# Altium schematic sheet Bulkhead_Connector.SchDoc
size A
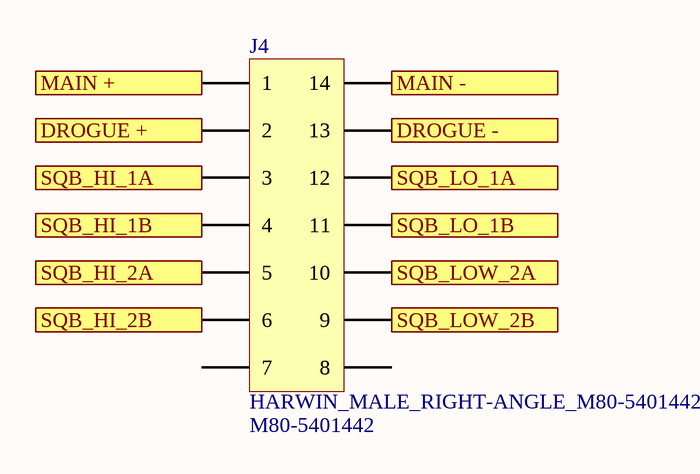
[diagram p0: Bulkhead_Connector.SchDoc]

## Parts
J4  HARWIN_MALE_RIGHT-ANGLE_M80-5401442  Manufacturer Part Number: M80-5401442  [HARWIN_M80-5401442]

## Ports
DROGUE + (in), DROGUE - (in), MAIN + (in), MAIN - (in), SQB_HI_1A (in), SQB_HI_1B (in), SQB_HI_2A (in), SQB_HI_2B (in), SQB_LO_1A (in), SQB_LO_1B (in), SQB_LOW_2A (in), SQB_LOW_2B (in)

## Nets
DROGUE +: J4.2 ; port DROGUE +
DROGUE -: J4.13 ; port DROGUE -
MAIN +: J4.1 ; port MAIN +
MAIN -: J4.14 ; port MAIN -
SQB_HI_1A: J4.3 ; port SQB_HI_1A
SQB_HI_1B: J4.4 ; port SQB_HI_1B
SQB_HI_2A: J4.5 ; port SQB_HI_2A
SQB_HI_2B: J4.6 ; port SQB_HI_2B
SQB_LO_1A: J4.12 ; port SQB_LO_1A
SQB_LO_1B: J4.11 ; port SQB_LO_1B
SQB_LOW_2A: J4.10 ; port SQB_LOW_2A
SQB_LOW_2B: J4.9 ; port SQB_LOW_2B

Not connected (* = marked no-connect by the designer): J4 7 8

## Library data of the parts
J4 = CMP-030-0115-1: 7+7 POS R/A MALE 3mm TAIL W/JS TIN; Manufacturer: Harwin; Pitch: 2mm; Number of poles: 14; Wire connection method: Solder; Number of arrays: 2; Source: connector.SchLib; ComponentLink1URL: https://datasheet.ciiva.com/11751/0900766b80d93463-11751065.pdf; ComponentLink2Description: https://datasheet.ciiva.com/733/m80-540-733786.pdf; Height: 6.05mm; Stock 1: 61; ComponentLink1Description: https://datasheet.ciiva.com/11751/0900766b80d93463-11751065.pdf; ComponentLink3URL: https://datasheet.ciiva.com/41451/001233329-da-01-en-stiftleiste-einbau-gewinkelt-m80-5401442-41451405.pdf; ComponentLink2URL: https://datasheet.ciiva.com/733/m80-540-733786.pdf; Design Item ID: HARWIN_MALE_RIGHT-ANGLE_M80-5401442; Pricing 1: 1=18.11, 10=16.81, 50=14.66, 100=12.93, 1000=11.81, 10000=11.81 (USD); ComponentLink3Description: https://datasheet.ciiva.com/41451/001233329-da-01-en-stiftleiste-einbau-gewinkelt-m80-5401442-41451405.pdf; Length: 24mm